# Altium project USBDAC_pcm2706.PrjPCB
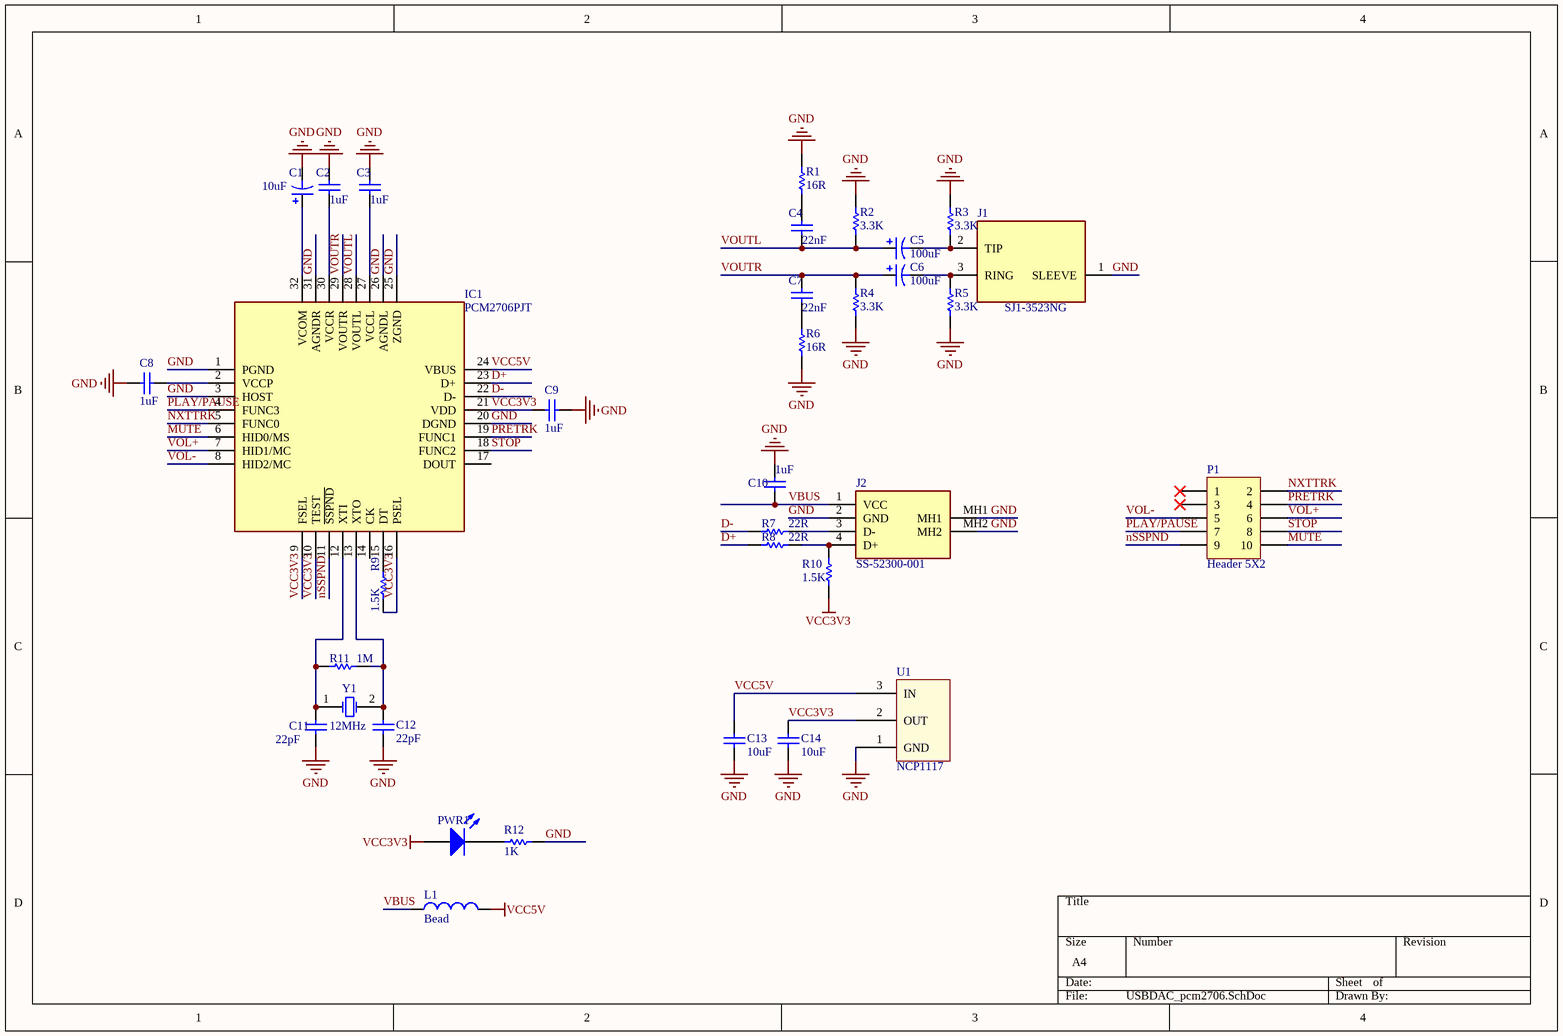
[diagram p0: USBDAC_pcm2706.SchDoc]
2 sheets, 44 parts. Net scope: global (net labels, ports and power ports of the same name join across sheets).
Board files: USBDAC_pcm2706.PcbDoc, User_buttom.PcbDoc
Sheets:
  USBDAC_pcm2706.SchDoc
  User_buttom.SchDoc

## Sheet USBDAC_pcm2706.SchDoc
size A4

### Parts
C1  10uF  [dip_cap]
C2  1uF  [SMD0805_CAP]
C3  1uF  [SMD0805_CAP]
C4  22nF  [SMD0805_CAP]
C5  100uF  [dip_cap]
C6  100uF  [dip_cap]
C7  22nF  [SMD0805_CAP]
C8  1uF  [SMD0805_CAP]
C9  1uF  [SMD0805_CAP]
C10  1uF  [SMD0805_CAP]
C11  22pF  [SMD0805_CAP]
C12  22pF  [SMD0805_CAP]
C13  10uF  [SMD0805_CAP]
C14  10uF  [SMD0805_CAP]
IC1  PCM2706PJT  [QFP80P900X900X120-32N]
J1  SJ1-3523NG  [SJ13523NG]
J2  SS-52300-001  [SS52300001]
L1  Bead  [SMD0805]
P1  Header 5X2  [HDR2X5]
PWR1  LED0  [LED]  (value not drawn)
R1  value 16R  [SMD0805]  (hidden comment: 1K)
R2  3.3K  [SMD0805]
R3  3.3K  [SMD0805]
R4  3.3K  [SMD0805]
R5  3.3K  [SMD0805]
R6  value 16R  [SMD0805]  (hidden comment: 1K)
R7  22R  [SMD0805]
R8  22R  [SMD0805]
R9  1.5K  [SMD0805]
R10  1.5K  [SMD0805]
R11  1M  [SMD0805]
R12  1K  [SMD0805]
U1  NCP1117  [SOT-223-2]
Y1  12MHz  [XTAL_DIP]

### Nets
GND: C1.2 C2.1 C3.1 C8.1 C9.1 C10.1 C11.2 C12.2 C13.1 C14.1 IC1.1(PGND) IC1.3(HOST) IC1.20(DGND) IC1.25(ZGND) IC1.26(AGNDL) IC1.31(AGNDR) J1.1(SLEEVE) J2.2(GND) J2.MH1 J2.MH2 R1.2 R2.2 R3.2 R4.1 R5.1 R6.2 R12.1 U1.1(GND)
VCC3V3: C9.2 C14.2 IC1.9(FSEL) IC1.10(TEST) IC1.16(PSEL) IC1.21(VDD) PWR1.1(A) R9.1 R10.1 U1.2(OUT)
VCC5V: C13.2 IC1.24(VBUS) L1.2 U1.3(IN)
D+: IC1.23(D+) R8.1
D-: IC1.22(D-) R7.1
MUTE: IC1.6(HID0/MS) P1.10
nSSPND: IC1.11(~{SSPND}) P1.9
NXTTRK: IC1.5(FUNC0) P1.2
PLAY/PAUSE: IC1.4(FUNC3) P1.7
PRETRK: IC1.19(FUNC1) P1.4
STOP: IC1.18(FUNC2) P1.8
VBUS: C10.2 J2.1(VCC) L1.1
VOL+: IC1.7(HID1/MC) P1.6
VOL-: IC1.8(HID2/MC) P1.5
VOUTL: C4.1 C5.1 IC1.28(VOUTL) R2.1
VOUTR: C6.1 C7.1 IC1.29(VOUTR) R4.2
NetC1_1: C1.1 IC1.32(VCOM)
NetC2_2: C2.2 IC1.30(VCCR)
NetC3_2: C3.2 IC1.27(VCCL)
NetC4_2: C4.2 R1.1
NetC5_2: C5.2 J1.2(TIP) R3.1
NetC6_2: C6.2 J1.3(RING) R5.2
NetC7_2: C7.2 R6.1
NetC8_2: C8.2 IC1.2(VCCP)
NetC11_1: C11.1 IC1.12(XTI) R11.1 Y1.1(OSC1)
NetC12_1: C12.1 IC1.13(XTO) R11.2 Y1.2(OSC2)
NetIC1_15: IC1.15(DT) R9.2
NetJ2_3: J2.3(D-) R7.2
NetJ2_4: J2.4(D+) R8.2 R10.2
NetPWR1_2: PWR1.2(K) R12.2

Not connected (* = marked no-connect by the designer): IC1 14(CK) 17(DOUT); P1 1* 3*

### Library data of the parts
C1 C5 C6 = Cap Pol1: Polarized Capacitor (Radial); Published: 8-Jun-2000; LatestRevisionDate: 17-Jul-2002; LatestRevisionNote: Re-released for DXP Platform.; PackageReference: RB7.6-15; Publisher: Altium Limited; PackageDescription: Polarized Capacitor (Radial); 2 Leads
  C1: Value: 10uF
  C5 C6: Value: 100uF
C2-C4 C7-C14 = Cap Semi: Capacitor (Semiconductor SIM Model); Published: 8-Jun-2000; LatestRevisionDate: 29-May-2009; LatestRevisionNote: IPC-7351 Footprint Added.; PackageReference: C1206; Publisher: Altium Limited; PackageDescription: Chip Capacitor
  C2 C3 C8-C10: Value: 1uF
  C4 C7: Value: 22nF
  C11 C12: Value: 22pF
  C13 C14: Value: 10uF
IC1 = PCM2706PJT: Integrated Circuit; Manufacturer_Name: Texas Instruments; Datasheet Link: http://www.ti.com/lit/gpn/pcm2706; Height: 1.2mm; Manufacturer_Part_Number: PCM2706PJT
J1 = SJ1-3523NG: Connector; Manufacturer_Name: CUI Inc.; Datasheet Link: https://www.arrow.com/en/products/sj1-3523ng/cui-devices; Height: 5.6mm; Manufacturer_Part_Number: SJ1-3523NG
J2 = SS-52300-001: Connector; Manufacturer_Name: Bel; Datasheet Link: https://belfuse.com/resources/datasheets/stewartconnector/ds-stw-usb-2.0-type-b-connectors.pdf; Height: 10.82mm; Manufacturer_Part_Number: SS-52300-001
L1 = Inductor: Code_IEC: 1005; Published: 8-Jun-2000; LatestRevisionDate: 29-May-2009; LatestRevisionNote: IPC-7351 Footprint Added.; PackageReference: 0402-A; Publisher: Altium Limited; PackageDescription: Chip Inductor; Code_JEITA: 0402; Value: Bead
P1 = Header 5X2: Header, 5-Pin, Dual row; LatestRevisionDate: 17-Jul-2002; LatestRevisionNote: Re-released for DXP Platform.; Publisher: Altium Limited
PWR1 = LED0: Typical INFRARED GaAs LED; Published: 8-Jun-2000; LatestRevisionDate: 08-Jul-2005; LatestRevisionNote: Mech Layer 1 removed.; PackageReference: LED-0; Publisher: Altium Limited; PackageDescription: LED; 2 Leads
R1-R12 = Res Semi: Semiconductor Resistor; Published: 8-Jun-2000; LatestRevisionDate: 17-Jul-2002; LatestRevisionNote: Re-released for DXP Platform.; PackageReference: AXIAL-0.5; Publisher: Altium Limited; PackageDescription: Axial Device, Thru-Hole; 2 Leads; 0.5 in Pin Spacing
  R2-R5: Value: 3.3K
  R7 R8: Value: 22R
  R9 R10: Value: 1.5K
  R11: Value: 1M
  R12: Value: 1K
U1 = NCP1117: IC REG 5V 1A DPAC
Y1 = XTAL: Crystal Oscillator 8MHz; Published: 8-Jun-2000; LatestRevisionDate: 17-Jul-2002; LatestRevisionNote: Re-released for DXP Platform.; PackageReference: R38; Publisher: Altium Limited; PackageDescription: Crystal, Thru-Hole; 2 Leads; Body 3.1 x 8.2 mm (Dia.xH)

## Sheet User_buttom.SchDoc
size A4
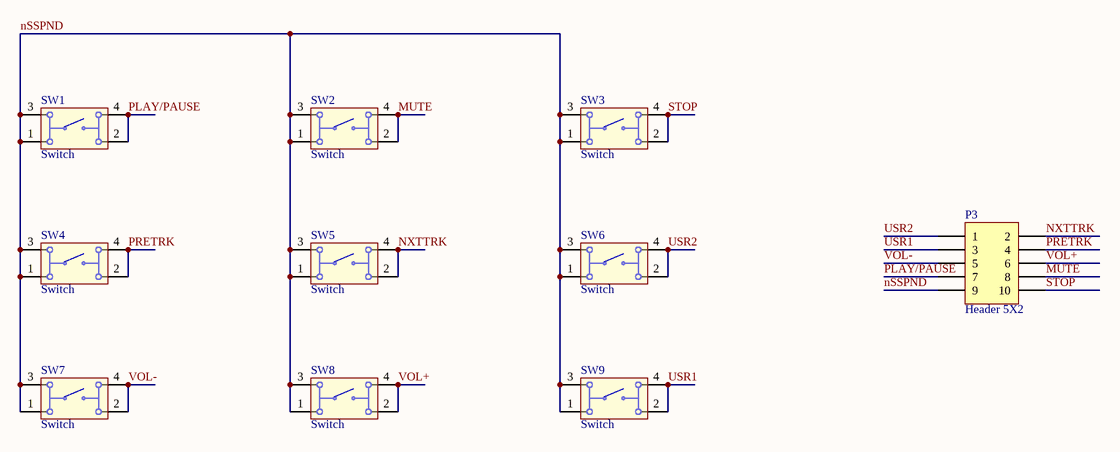
[diagram p1: User_buttom.SchDoc]

### Parts
P3  Header 5X2  [HDR2X5]
SW1  Switch  [430156050726]
SW2  Switch  [430156050726]
SW3  Switch  [430156050726]
SW4  Switch  [430156050726]
SW5  Switch  [430156050726]
SW6  Switch  [430156050726]
SW7  Switch  [430156050726]
SW8  Switch  [430156050726]
SW9  Switch  [430156050726]

### Nets
MUTE: P3.8 SW2.2 SW2.4
nSSPND: P3.9 SW1.1 SW1.3 SW2.1 SW2.3 SW3.1 SW3.3 SW4.1 SW4.3 SW5.1 SW5.3 SW6.1 SW6.3 SW7.1 SW7.3 SW8.1 SW8.3 SW9.1 SW9.3
NXTTRK: P3.2 SW5.2 SW5.4
PLAY/PAUSE: P3.7 SW1.2 SW1.4
PRETRK: P3.4 SW4.2 SW4.4
STOP: P3.10 SW3.2 SW3.4
USR1: P3.3 SW9.2 SW9.4
USR2: P3.1 SW6.2 SW6.4
VOL+: P3.6 SW8.2 SW8.4
VOL-: P3.5 SW7.2 SW7.4

### Library data of the parts
P3 = Header 5X2: Header, 5-Pin, Dual row; LatestRevisionDate: 17-Jul-2002; LatestRevisionNote: Re-released for DXP Platform.; Publisher: Altium Limited
SW1-SW9 = 430156050726: WS-TATV THT Tact Switch 6X6 mm; NoPins: 04; PackageReference: 430156050726; PartNumber: 430156050726; ComponentLink1Description: Manufacturer URL; ComponentLink1URL: http://www.we-online.com; ComponentLink2Description: Datasheet; ComponentLink2URL: http://katalog.we-online.de/em/datasheet/4301x6.pdf

## Nets that join several sheets
MUTE: USBDAC_pcm2706 (IC1.6 P1.10), User_buttom (P3.8 SW2.2 SW2.4)
nSSPND: USBDAC_pcm2706 (IC1.11 P1.9), User_buttom (19 pins)
NXTTRK: USBDAC_pcm2706 (IC1.5 P1.2), User_buttom (P3.2 SW5.2 SW5.4)
PLAY/PAUSE: USBDAC_pcm2706 (IC1.4 P1.7), User_buttom (P3.7 SW1.2 SW1.4)
PRETRK: USBDAC_pcm2706 (IC1.19 P1.4), User_buttom (P3.4 SW4.2 SW4.4)
STOP: USBDAC_pcm2706 (IC1.18 P1.8), User_buttom (P3.10 SW3.2 SW3.4)
VOL+: USBDAC_pcm2706 (IC1.7 P1.6), User_buttom (P3.6 SW8.2 SW8.4)
VOL-: USBDAC_pcm2706 (IC1.8 P1.5), User_buttom (P3.5 SW7.2 SW7.4)